# EAGLE design CDU (EAGLE 9.6.2)
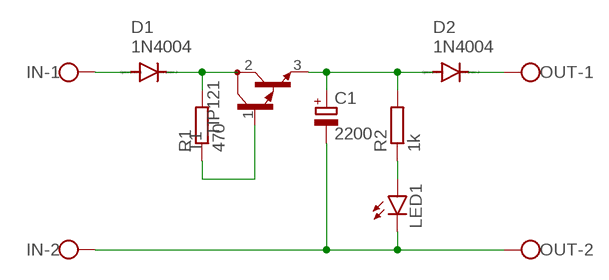
[diagram p0: schematic, sheet 1]

## Parts
C1  2200  CPOL-EUE7.5-18  [E7,5-18]
D1  1N4004  [DO41-10]
D2  1N4004  [DO41-10]
IN  W237-102  [W237-102]
LED1  LED5MM  [LED5MM]
OUT  W237-102  [W237-102]
R1  470  R-EU_0411/15  [0411/15]
R2  1k  R-EU_0207/10  [0207/10]
T1  TIP121  [TO220V]

## Nets
N$1: D1.A IN.1
N$2: D1.C R1.2 T1.2(C)
N$3: R1.1 T1.1(B)
N$4: C1.+ D2.A R2.2 T1.3(E)
N$5: D2.C OUT.1
N$6: LED1.A R2.1
N$7: C1.- IN.2 LED1.K(C) OUT.2

## Library data of the parts
C1 = rcl:CPOL-EU: POLARIZED CAPACITOR, European symbol; SPICEPREFIX: C
D1 D2 = diode:1N4004: DIODE general purpose rectifier, 1 A
IN OUT = con-wago-500:W237-102: WAGO SCREW CLAMP; MPN: 237-102; OC_FARNELL: unknown; OC_NEWARK: 70K9898
LED1 = led:LED: LED OSRAM: - CHIPLED LG R971, LG N971, LY N971, LG Q971, LY Q971, LO R971, LY R971 LH N974, LH R974 LS Q976, LO Q976, LY Q976 LO Q996 - Hyper CHIPLED LW Q18S LB Q993, LB Q99A, LB R99A - SideLED LS A670, LO A670, LY A670, LG A670, LP A670 LB A673, LV A673, LT A673, LW A673 LH A674 LY A675 LS A676, LA A676, LO A676, LY A676, LW A676 LS A679, LY A679, LG A679 - Hyper Micro SIDELED® LS Y876, LA Y876, LO Y876, LY Y876 LT Y87S - SmartLED LW L88C, LW L88S LB L89C, LB L89S, LG L890 LS L89K, LO L89K, LY L89K LS L896, LA L896, LO L896, LY L896 - TOPLED LS T670, LO T670, LY T670, LG T670, LP T670 LSG T670, LSP T670, LSY T670, LOP T670, LYG T670 LG T671, LOG T671, LSG T671 LB T673, LV T673, LT T673, LW T673 LH T674 LS T676, LA T676, LO T676, LY T676, LB T676, LH T676, LSB T676, LW T676 LB T67C, LV T67C, LT T67C, LS T67K, LO T67K, LY T67K, LW E67C LS E67B, LA E67B, LO E67B, LY E67B, LB E67C, LV E67C, LT E67C LW T67C LS T679, LY T679, LG T679 LS T770, LO T770, LY T770, LG T770, LP T770 LB T773, LV T773, LT T773, LW T773 LH T774 LS E675, LA E675, LY E675, LS T675 LS T776, LA T776, LO T776, LY T776, LB T776 LHGB T686 LT T68C, LB T68C - Hyper Mini TOPLED® LB M676 - Mini TOPLED Santana® LG M470 LS M47K, LO M47K, LY M47K Source: http://www.osram.convergy.de LUXEON: - LUMILED® LXK2-PW12-R00, LXK2-PW12-S00, LXK2-PW14-U00, LXK2-PW14-V00 LXK2-PM12-R00, LXK2-PM12-S00, LXK2-PM14-U00 LXK2-PE12-Q00, LXK2-PE12-R00, LXK2-PE12-S00, LXK2-PE14-T00, LXK2-PE14-U00 LXK2-PB12-K00, LXK2-PB12-L00, LXK2-PB12-M00, LXK2-PB14-N00, LXK2-PB14-P00, LXK2-PB14-Q00 LXK2-PR12-L00, LXK2-PR12-M00, LXK2-PR14-Q00, LXK2-PR14-R00 LXK2-PD12-Q00, LXK2-PD12-R00, LXK2-PD12-S00 LXK2-PH12-R00, LXK2-PH12-S00 LXK2-PL12-P00, LXK2-PL12-Q00, LXK2-PL12-R00 Source: www.luxeon.com KINGBRIGHT: KA-3528ASYC Source: www.kingbright.com
R1 R2 = rcl:R-EU_: RESISTOR, European symbol; SPICEPREFIX: R
T1 = LucaDentella:TIP121

## Net classes
0 default: width 1.016 mm

## Board
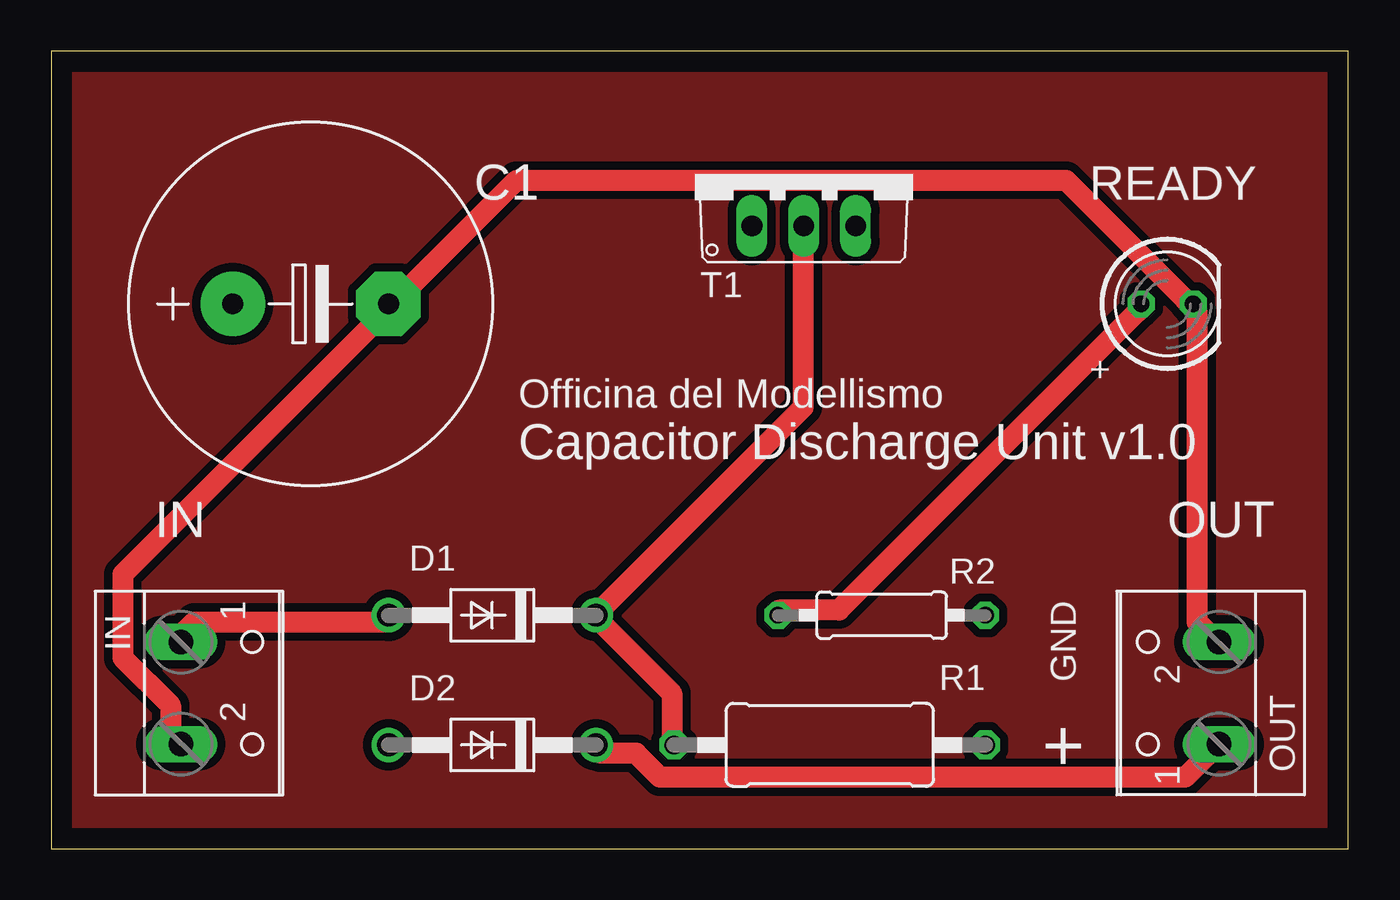
[diagram p1: board, top side]
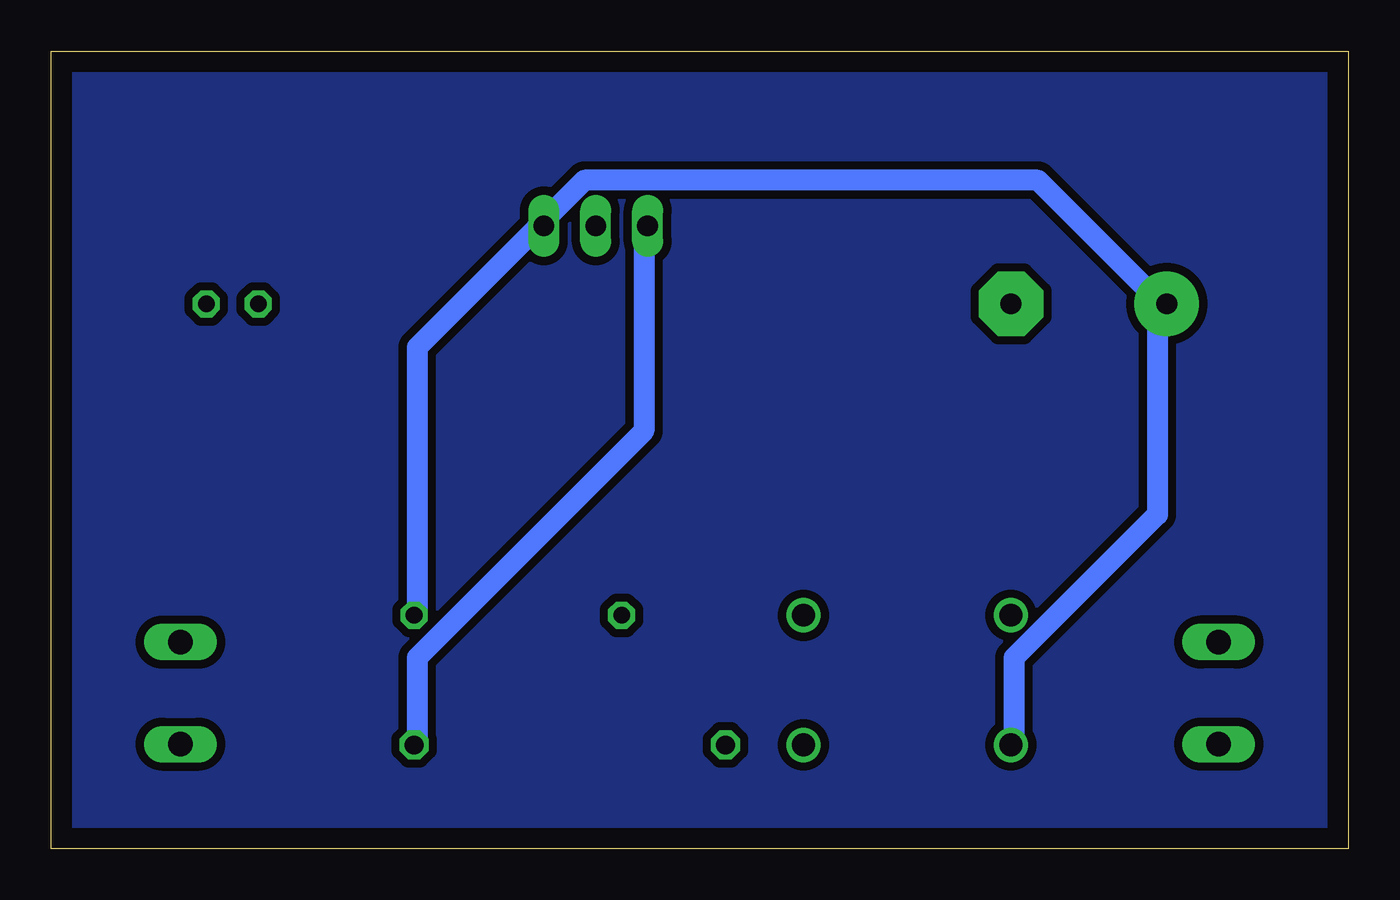
[diagram p2: board, bottom side, seen from below]

Size 63.48 x 39.04 mm. Coordinates in mm from the lower left corner, seen from the top.
Outline: 0,0 63.48,0 63.48,39.04 0,39.04 0,0
Copper layers (1*16): Top 0.035mm / dielectric 1.5mm / Bottom 0.035mm
Design rules "default": minimum track width 6mil, minimum drill 0.35mm, track to track 6mil, track to pad 6mil, pad to pad 6mil, via to via 6mil, smd to smd 6mil, copper to edge 40mil, drill to drill 6mil, minimum pad ring 10mil, minimum via ring 8mil, stop-mask expansion 4mil, vias tented up to drill 0mil, thermal gap 10mil

### Footprints (pad centres in the part's own frame; a part is rotated, then mirrored left to right if it is on the bottom)
E7,5-18 = drill 1.016 pad 3.15: + -3.81,0 | drill 1.016 pad 3.15 octagon: - 3.81,0
DO41-10 = drill 1.118: A 5.08,0; C -5.08,0
W237-102 = drill 1.194 long: 1 -2.5,-1.27; 2 2.5,-1.27
LED5MM = drill 0.813 octagon: A -1.27,0; K 1.27,0
0411/15 = drill 0.914 octagon: 1 -7.62,0; 2 7.62,0
0207/10 = drill 0.813 octagon: 1 -5.08,0; 2 5.08,0
TO220V = drill 1.016 long: 1 -2.54,-2.54; 2 0,-2.54; 3 2.54,-2.54

### Placement (x,y rotation side)
C1  12.7,26.67 0 top
D1  21.59,11.43 180 top
D2  21.59,5.08 180 top
IN  7.62,7.62 270 top
LED1  54.61,26.67 0 top
OUT  55.88,7.62 90 top
R1  38.1,5.08 180 top
R2  40.64,11.43 0 top
T1  36.83,33.02 0 top

### Tracks (layer width: path | path; a pad name or v marks a point on that pad's centre or on a via)
GND
  pour Top (isolate 0.406): 0,39.37 0,0 63.5,0 63.5,39.37
  pour Bottom (isolate 0.406): 0,39.37 0,0 63.5,0 63.5,39.37
N$1
  Top 1.016: D1.A 16.36,11.1 7.01,11.1 6.43,10.52 IN.1
N$2
  Top 1.016: R1.2 30.38,5.26 30.38,7.59 26.87,11.1 D1.C 26.87,11.68 36.8,21.61 36.8,30.38 T1.2
N$3
  Bottom 1.016: R1.1 45.57,5.26 45.57,9.35 34.47,20.45 34.47,30.38 T1.1
N$4
  Bottom 1.016: R2.2 45.57,11.68 45.57,24.54 39.73,30.38 T1.3 39.14,30.96 37.39,32.72 15.19,32.72 9.35,26.87 C1.+ 9.35,26.29 9.35,16.36 16.36,9.35 16.36,5.26 D2.A
N$5
  Top 1.016: D2.C 26.87,4.67 28.63,4.67 29.79,3.5 55.5,3.5 56.67,4.67 OUT.1
N$6
  Top 1.016: R2.1 35.64,11.68 38.56,11.68 53.16,26.29 LED1.A
N$7
  Top 1.016: OUT.2 56.67,10.52 56.08,11.1 56.08,26.29 LED1.K 55.5,26.87 49.66,32.72 22.78,32.72 16.94,26.87 C1.- 16.36,26.29 3.5,13.44 3.5,9.35 5.84,7.01 5.84,5.26 IN.2

### Text on the board
tPlace: READY | + | Officina del Modellismo | Capacitor Discharge Unit v1.0 | IN | OUT | GND | +